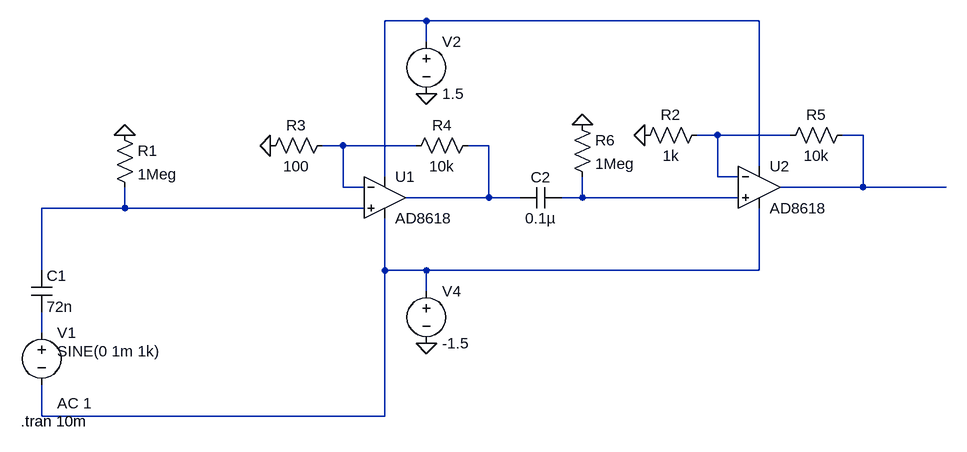
[diagram p0: schematic Condenser_Mic_FET_Amp.asc]
Condenser_Mic_FET_Amp.asc, the LTspice schematic file:
Version 4
SHEET 1 1460 680
WIRE 656 -320 592 -320
WIRE 1168 -320 656 -320
WIRE 656 -288 656 -320
WIRE 1104 -144 1072 -144
WIRE 1216 -144 1104 -144
WIRE 1328 -144 1296 -144
WIRE 528 -128 496 -128
WIRE 640 -128 528 -128
WIRE 752 -128 720 -128
WIRE 1168 -96 1168 -320
WIRE 592 -80 592 -320
WIRE 1104 -80 1104 -144
WIRE 1136 -80 1104 -80
WIRE 528 -64 528 -128
WIRE 560 -64 528 -64
WIRE 1328 -64 1328 -144
WIRE 1328 -64 1200 -64
WIRE 1456 -64 1328 -64
WIRE 752 -48 752 -128
WIRE 752 -48 624 -48
WIRE 800 -48 752 -48
WIRE 896 -48 896 -80
WIRE 896 -48 864 -48
WIRE 1136 -48 896 -48
WIRE 192 -32 192 -64
WIRE 192 -32 64 -32
WIRE 560 -32 192 -32
WIRE 64 64 64 -32
WIRE 592 64 592 -16
WIRE 656 64 592 64
WIRE 1168 64 1168 -32
WIRE 1168 64 656 64
WIRE 656 96 656 64
WIRE 64 160 64 128
WIRE 64 288 64 240
WIRE 592 288 592 64
WIRE 592 288 64 288
FLAG 656 -208 0
FLAG 656 176 0
FLAG 416 -128 0
FLAG 192 -144 0
FLAG 992 -144 0
FLAG 896 -160 0
SYMBOL voltage 64 144 R0
WINDOW 123 24 124 Left 2
WINDOW 39 0 0 Left 0
WINDOW 3 24 44 Left 2
SYMATTR Value2 AC 1
SYMATTR Value SINE(0 1m 1k)
SYMATTR InstName V1
SYMBOL cap 48 64 R0
SYMATTR InstName C1
SYMATTR Value 72n
SYMBOL Opamps\\AD8618 592 -48 R0
SYMATTR InstName U1
SYMBOL res 176 -160 R0
SYMATTR InstName R1
SYMATTR Value 1Meg
SYMBOL voltage 656 -304 R0
SYMATTR InstName V2
SYMATTR Value 1.5
SYMBOL res 512 -144 R90
WINDOW 0 0 56 VBottom 2
WINDOW 3 32 56 VTop 2
SYMATTR InstName R3
SYMATTR Value 100
SYMBOL res 736 -144 R90
WINDOW 0 0 56 VBottom 2
WINDOW 3 32 56 VTop 2
SYMATTR InstName R4
SYMATTR Value 10k
SYMBOL voltage 656 80 R0
SYMATTR InstName V4
SYMATTR Value -1.5
SYMBOL Opamps\\AD8618 1168 -64 R0
SYMATTR InstName U2
SYMBOL res 1088 -160 R90
WINDOW 0 0 56 VBottom 2
WINDOW 3 32 56 VTop 2
SYMATTR InstName R2
SYMATTR Value 1k
SYMBOL res 1312 -160 R90
WINDOW 0 0 56 VBottom 2
WINDOW 3 32 56 VTop 2
SYMATTR InstName R5
SYMATTR Value 10k
SYMBOL res 880 -176 R0
SYMATTR InstName R6
SYMATTR Value 1Meg
SYMBOL cap 864 -64 R90
WINDOW 0 0 32 VBottom 2
WINDOW 3 32 32 VTop 2
SYMATTR InstName C2
SYMATTR Value 0.1µ
TEXT 32 296 Left 2 !.tran 10m

The netlist it stands for:
* Condenser_Mic_FET_Amp.asc
V1 N009 N008 SINE(0 1m 1k) AC 1
C1 N007 N009 72n
* U1: AD8618 (symbol Opamps\AD8618 not available, pins judged from their places): In+=N007 In-=N004 V+=N001 V-=N008 OUT=N005
R1 0 N007 1Meg
V2 N001 0 1.5
R3 N004 0 100
R4 N005 N004 10k
V4 N008 0 -1.5
* U2: AD8618 (symbol Opamps\AD8618 not available, pins judged from their places): In+=N006 In-=N002 V+=N001 V-=N008 OUT=N003
R2 N002 0 1k
R5 N003 N002 10k
R6 0 N006 1Meg
C2 N006 N005 0.1µ
.tran 10m
.backanno
.end